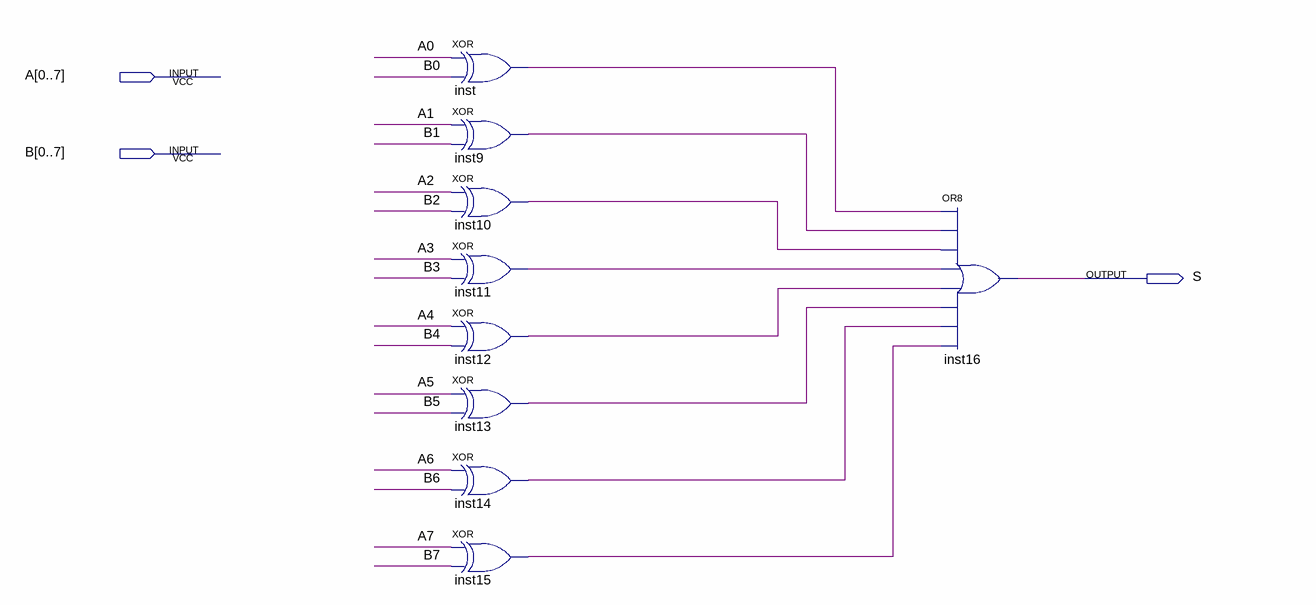
[diagram p0: schematic sheet]
// Quartus schematic AxorB8bits.bdf as structural Verilog: 9 symbols, 3 pins
module AxorB8bits (
  input  [0:7] A,
  input  [0:7] B,
  output S
);

  wire inst9_out, inst10_out, inst11_out, inst12_out, inst13_out, inst14_out, inst15_out, inst_out;

  xor inst (inst_out, A[0], B[0]);
  xor inst9 (inst9_out, A[1], B[1]);
  xor inst10 (inst10_out, A[2], B[2]);
  xor inst11 (inst11_out, A[3], B[3]);
  xor inst12 (inst12_out, A[4], B[4]);
  xor inst13 (inst13_out, A[5], B[5]);
  xor inst14 (inst14_out, A[6], B[6]);
  xor inst15 (inst15_out, A[7], B[7]);
  or inst16 (S, inst_out, inst9_out, inst10_out, inst11_out, inst12_out, inst13_out, inst14_out, inst15_out);
endmodule
